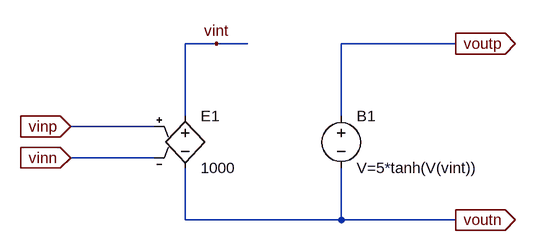
[diagram p0: schematic tanh_amp.asc]
tanh_amp.asc, the LTspice schematic file:
Version 4
SHEET 1 880 680
WIRE 400 160 352 160
WIRE 448 160 400 160
WIRE 768 160 592 160
WIRE 352 272 352 160
WIRE 592 272 592 160
WIRE 304 288 176 288
WIRE 304 336 176 336
WIRE 352 432 352 352
WIRE 592 432 592 352
WIRE 592 432 352 432
WIRE 768 432 592 432
FLAG 400 160 vint
FLAG 176 288 vinp
IOPIN 176 288 In
FLAG 176 336 vinn
IOPIN 176 336 In
FLAG 768 160 voutp
IOPIN 768 160 Out
FLAG 768 432 voutn
IOPIN 768 432 Out
SYMBOL e 352 256 R0
SYMATTR InstName E1
SYMATTR Value 1000
SYMBOL voltage 592 256 R0
SYMATTR InstName B1
SYMATTR Value V=5*tanh(V(vint))

The netlist it stands for:
* tanh_amp.asc
E1 vint voutn vinp vinn 1000
V§B1 voutp voutn V=5*tanh(V(vint))
.backanno
.end